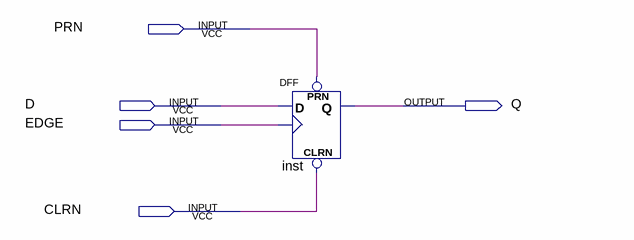
[diagram p0: schematic sheet]
// Quartus schematic Akram_10_3_2021_DFF.bdf as structural Verilog: 1 symbols, 5 pins
module Akram_10_3_2021_DFF (
  input  PRN,
  input  D,
  input  EDGE,
  input  CLRN,
  output Q
);

  DFF inst (.CLRN(CLRN), .CLK(EDGE), .D(D), .PRN(PRN), .Q(Q));
endmodule
